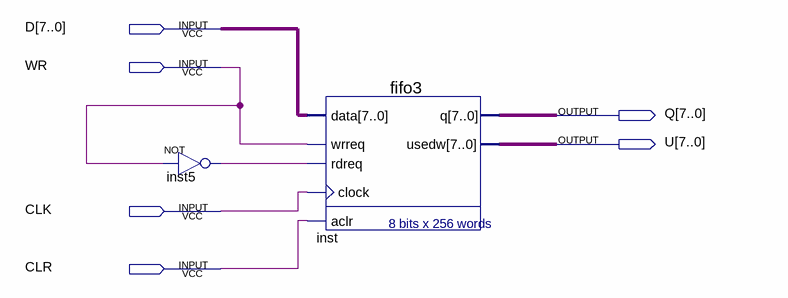
[diagram p0: schematic sheet]
// Quartus schematic FIFO.bdf as structural Verilog: 2 symbols, 6 pins
module FIFO (
  input  [7:0] D,
  input  WR,
  input  CLK,
  input  CLR,
  output [7:0] Q,
  output [7:0] U
);

  wire inst5_out;

  not inst5 (inst5_out, WR);
  fifo3 inst (.data(D), .wrreq(WR), .rdreq(inst5_out), .clock(CLK), .aclr(CLR), .q(Q), .usedw(U));
endmodule
